# Altium schematic sheet MCU_Power.SchDoc
size A4
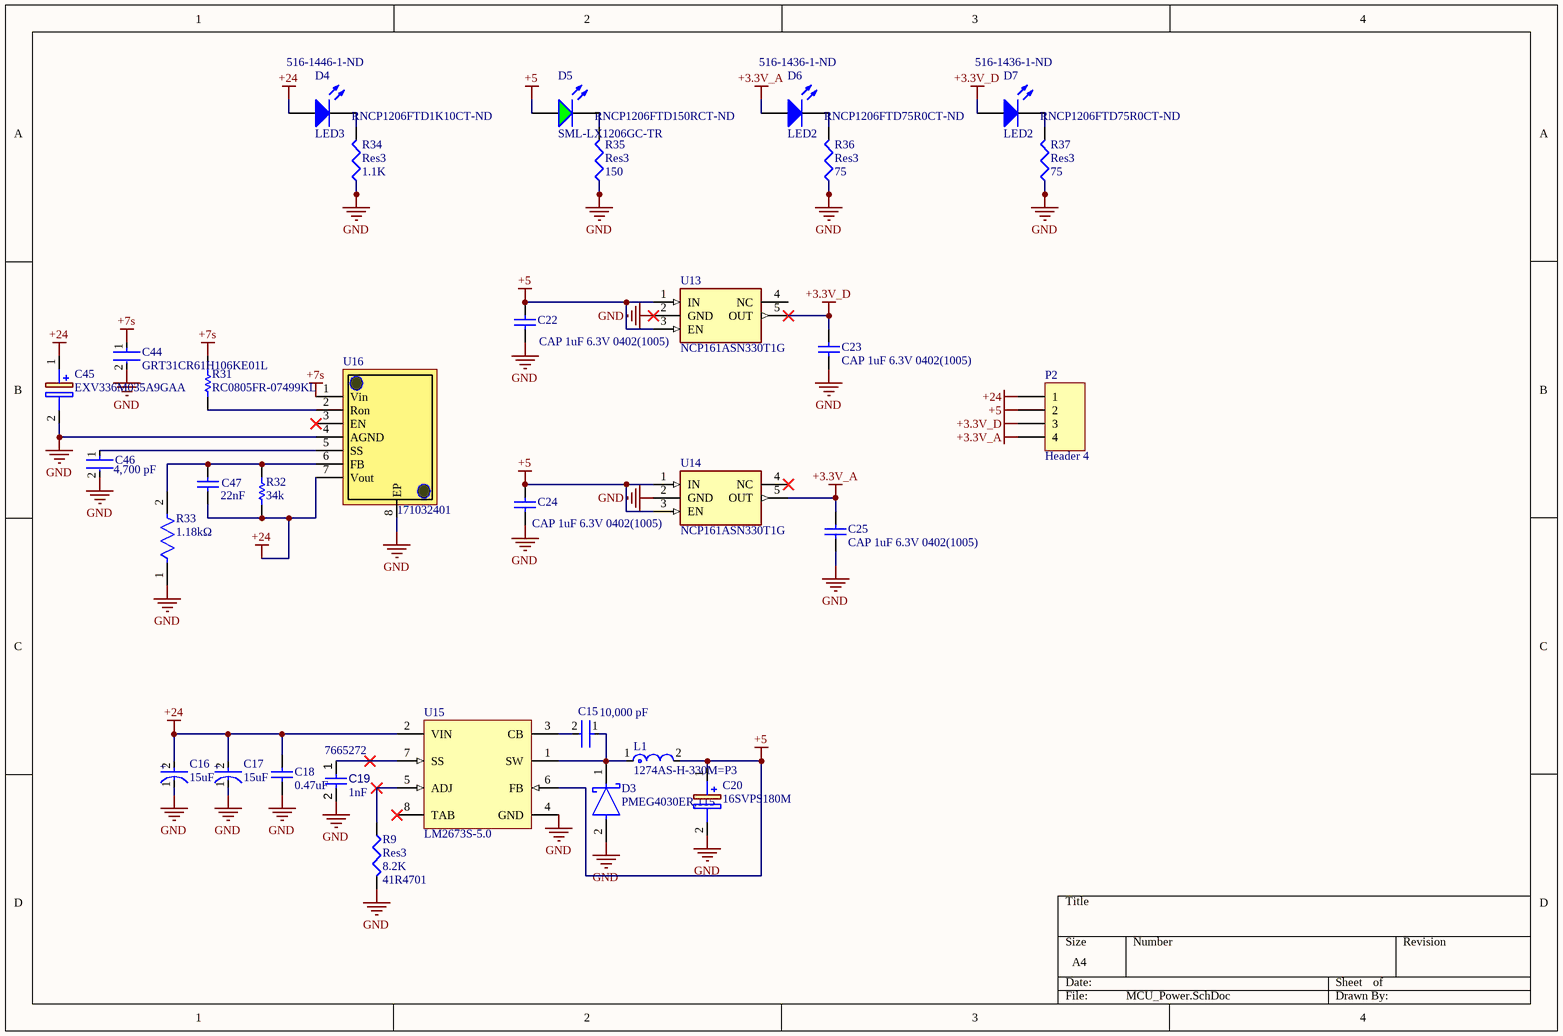
[diagram p0: MCU_Power.SchDoc]

## Parts
C15  value 10,000 pF  [FP-C0805C-DN-MFG]  (hidden comment: C0805C103J5RACTU)
C16  value 15uF  [FP-TPSE-MFG]  (hidden comment: TPSE156M050R0250)
C17  value 15uF  [FP-TPSE-MFG]  (hidden comment: TPSE156M050R0250)
C18  Parameter 1: 0.47uF  [CAPC2013X140X50ML20T25]  (hidden comment: C0805F474K3RACTU)
C19  value 1nF  Supplier Part Number 1: 7665272  [CAPC1608X90X40NL10T20]  (hidden comment: CAP CER 1000PF 50V X7R 0603)
C20  16SVPS180M  [10SVPS150M]
C22  CAP 1uF 6.3V 0402(1005)  [CAPC0402(1005)60_L]
C23  CAP 1uF 6.3V 0402(1005)  [CAPC0402(1005)60_L]
C24  CAP 1uF 6.3V 0402(1005)  [CAPC0402(1005)60_L]
C25  CAP 1uF 6.3V 0402(1005)  [CAPC0402(1005)60_L]
C44  GRT31CR61H106KE01L  [FP-GRT31C-0_2-IPC_A]
C45  EXV336M035A9GAA  [CAPAE660X565N]
C46  Capacitance: 4,700 pF  [FP-C0805C-DN-MFG]  (hidden comment: C0805C472K5RACTU)
C47  22nF  [CAPC2013X145X50NL20T25]
D3  PMEG4030ER,115  [FP-SOD123W-MFG]
D4  LED3  Supplier Part Number 1: 516-1446-1-ND  [C1206]
D5  SML-LX1206GC-TR  [LUMX-SML-LX1206GC-TR_V]
D6  LED2  Supplier Part Number 1: 516-1436-1-ND  [C1206]
D7  LED2  Supplier Part Number 1: 516-1436-1-ND  [C1206]
L1  1274AS-H-330M=P3  [FP-DEM10050C-MFG]
P2  Header 4  [HDR1X4]
R9  Res3  value 8.2K  Supplier Part Number 1: 41R4701  [J1-0603]
R31  RC0805FR-07499KL  [RESC2013X60X35LL10T20]
R32  value 34k  [RESC2013X60X40ML20T25]  (hidden comment: ERA6AEB3402V)
R33  value 1.18kΩ  [FP-RT0805-MFG]  (hidden comment: RT0805BRE071K18L)
R34  Res3  value 1.1K  Supplier Part Number 1: RNCP1206FTD1K10CT-ND  [C1206]
R35  Res3  value 150  Supplier Part Number 1: RNCP1206FTD150RCT-ND  [C1206]
R36  Res3  value 75  Supplier Part Number 1: RNCP1206FTD75R0CT-ND  [C1206]
R37  Res3  value 75  Supplier Part Number 1: RNCP1206FTD75R0CT-ND  [C1206]
U13  NCP161ASN330T1G  [SOT95P280X145-5N]
U14  NCP161ASN330T1G  [SOT95P280X145-5N]
U15  LM2673S-5.0  [KTW0007B_N]
U16  171032401  [7 PIN PFM]

## Nets
+3.3V_A: C25.2 D6.1(A) P2.4 U14.5(OUT)
+3.3V_D: C23.2 D7.1(A) P2.3 U13.5(OUT)
+5: C20.1(+) C22.2 C24.2 D5.1(A) L1.2 P2.2 U13.1(IN) U13.3(EN) U14.1(IN) U14.3(EN) U15.6(FB)
+7s: C44.1 R31.2 U16.1(Vin)
+24: C16.2(A) C17.2(A) C18.1 C45.1(+) C47.1 D4.1(A) P2.1 R32.1 U15.2(VIN) U16.7(Vout)
GND: C16.1(C) C17.1(C) C18.2 C19.2 C20.2(-) C22.1 C23.1 C24.1 C25.1 C44.2 C45.2(-) C46.2 D3.2(A) R9.2 R33.1 R34.1 R35.1 R36.1 R37.1 U13.2(GND) U14.2(GND) U15.4(GND) U16.4(AGND) U16.8(EP)
NetC15_1: C15.1 D3.1(C) L1.1 U15.1(SW)
NetC15_2: C15.2 U15.3(CB)
NetC19_1: C19.1 U15.7(SS)
NetC46_1: C46.1 U16.5(SS)
NetC47_2: C47.2 R32.2 R33.2 U16.6(FB)
NetD4_2: D4.2(K) R34.2
NetD5_2: D5.2(K) R35.2
NetD6_2: D6.2(K) R36.2
NetD7_2: D7.2(K) R37.2
NetR9_1: R9.1 U15.5(ADJ)
NetR31_1: R31.1 U16.2(Ron)

Not connected (* = marked no-connect by the designer): U13 4(NC); U14 4(NC)*; U15 8(TAB)*; U16 3(EN)*

## Notes on the sheet
- (in symbol CMP-04424-000028-1) +

## Library data of the parts
C15 = CMP-2007-00254-2: CAP CER 10000PF 50V X7R 0805; Manufacturer: KEMET; Material: Ceramic; Temperature Coefficient: 30ppm/°C; Tolerance: 0.05; Device Class L1: Passive Components; Temperature: -55°C to +125°C; Lead Free: Yes; ComponentLink2URL: https://content.kemet.com/datasheets/KEM_C1003_C0G_SMD.pdf; Device Class L3: Ceramic Capacitors; Temperature Characteristic: X7R; Temperature Range High: +125°C; Mouser Description: Capacitor; Ceramic; Cap 0.01uF; Tol 5%; Vol-Rtg 50 V; SMT; Case 0805; X7R; TR; ComponentLink2Description: Datasheet; Manufacturer Part Number: C0805C103J5RACTU; Height: 0.88mm; Digikey Description: CAP CER 10000PF 50V X7R 0805; Capacitance: 10,000 pF; Temperature Range Low: -55°C; Device Class L2: Capacitors; Octopart: https://octopart.com/c0805c103j5ractu-kemet-133473; Voltage Rating: 50 V; Category: Cap; RoHS: TRUE; Automotive: No; Package: C0805C-DN; Ipc Land Pattern Name: CAPC200125X78
C16 C17 = CMP-04424-000028-1: CAP TANT 15UF 20% 50V 2917; Manufacturer: AVX Corporation; Ripple Current: 0.812A; Esr: 250mΩ; Leakage Current: 7.5uA; Dissipation Factor: 6%; Material: Tantalum Mn02 solid electrolyte; Life: 1000Hours; Device Class L2: Capacitors; Lead Free: Yes; Temperature Range High: +125°C; ComponentLink2Description: Datasheet; Height: 4.3mm; Temperature: -55°C to +125°C; Octopart: https://octopart.com/tpse156m050r0250-avx-7476984; Mouser Description: Tantalum Capacitors - Solid SMD 15uF 20% 50Volts; Device Class L1: Passive Components; Category: Cap; Digikey Description: CAP TANT 15UF 20% 50V 2917; RoHS: TRUE; Temperature Range Low: -55°C; Voltage Rating: 50V; Capacitance: 15uF; Tolerance: 20%; Automotive: No; Package: TPSE; ComponentLink2URL: http://datasheets.avx.com/TPS.pdf; Device Class L3: Tantalum Capacitors; Manufacturer Part Number: TPSE156M050R0250; Footprint Url: https://www.avx.com/download/software/literature/AVX-Footprint-Library.pdf
C18 = CMP-2007-03309-1: Manufacturer: Kemet; Part Number: C0805F474K3RACTU
C19 = CMP-001-00017-6: 1000 pF ±10% 50V Ceramic Capacitor X7R 0603 (1608 Metric); Manufacturer: Samsung; Manufacturer Part Number: CL10B102KB8NNNC; Tolerance: 10%; Voltage Rating: 50V; Mounting Technology: SM; Max Operating Temperature: 125°C; RoHS Compliant: True; Pins: 2; Capacitor Type: Ceramic; Case/Package: 0603; Min Operating Temperature: -55°C; Supplier 1: RSComponents; RoHS: Yes; Category: Ceramic Capacitors; Stock 1: 164000; Pricing 1: 4000=0.00800, 12000=0.00800, 20000=0.00800, 40000=0.00700, 100000=0.00700 (USD); Mount: Surface Mount; Case Code (Metric): 1608; Case Code (Imperial): 0603; Material: Ceramic; Contact Plating: Tin; Capacitance: 1nF; Dielectric: X7R; Package Quantity: 1; Packaging: Tape and Reel; Voltage: 50V; Voltage Rating (DC): 50V; Series: CL; Construction: Flat; Length: 1.6mm; Width: 0.031inch; Height: 0.8mm; Thickness: 0.035inch; Depth: 0.8mm; Radiation Hardening: No; Lead Free: Lead Free; ComponentLink1URL: https://datasheet.ciiva.com/25805/cl10b102kb8nnnc-25805137.pdf?src-supplier=Digi-Key; ComponentLink1Description: https://datasheet.ciiva.com/25805/cl10b102kb8nnnc-25805137.pdf?src-supplier=Digi-Key; ComponentLink2URL: https://datasheet.ciiva.com/15216/getdatasheetpartid-359690-15216231.pdf?src-supplier=Verical; ComponentLink2Description: https://datasheet.ciiva.com/15216/getdatasheetpartid-359690-15216231.pdf?src-supplier=Verical; ComponentLink3URL: https://datasheet.ciiva.com/29198/458300-da-01-en-vs-kondensator-0603-29198498.pdf?src-supplier=Conrad; ComponentLink3Description: https://datasheet.ciiva.com/29198/458300-da-01-en-vs-kondensator-0603-29198498.pdf?src-supplier=Conrad; ComponentLink4URL: https://datasheet.ciiva.com/16199/cl05b104kq5nnnc-16199064.pdf?src-supplier=Future+Electronics; ComponentLink4Description: https://datasheet.ciiva.com/16199/cl05b104kq5nnnc-16199064.pdf?src-supplier=Future+Electronics; ComponentLink5URL: https://datasheet.ciiva.com/26310/mlcc-catalogdownload2013-eng-26310326.pdf?src-supplier=Distrelec; ComponentLink5Description: https://datasheet.ciiva.com/26310/mlcc-catalogdownload2013-eng-26310326.pdf?src-supplier=Distrelec
C20 = 16SVPS180M: Capacitor Polarised; Manufacturer_Name: Panasonic; Datasheet Link: http://industrial.panasonic.com/cdbs/www-data/pdf/AAB8000/AAB8000C232.pdf; Height: 8mm; Manufacturer_Part_Number: 16SVPS180M; Mouser Part Number: 667-16SVPS180M; Mouser Price/Stock: https://www.mouser.co.uk/ProductDetail/Panasonic/16SVPS180M?qs=r271rpOLewtQLZd4uWya%252Bg%3D%3D; Arrow Part Number: 16SVPS180M; Arrow Price/Stock: https://www.arrow.com/en/products/16svps180m/panasonic
C22-C25 = CMP-1034-02113-1: CAP 1uF 6.3V ±10% 0402 (1005 Metric) Thickness 0.6mm SMD; Case-Metric: 1005; Case-EIA: 0402; Tolerance: Â±10%; Value: 1uF; Technology: SMT; Rated Voltage: 6.3 V; Max Thickness: 0.6 mm
C44 = CMP-06035-000076-2: Multi-Layer Ceramic Capacitor 10uF 50V X5R ±10% 1206 Emboss T/R; Length: 0.126inch; Max Operating Temperature: 85°C; Width: 0.063inch; Ratings: AEC-Q200; Voltage Rating: 50V; Dielectric: X5R; Min Operating Temperature: -55°C; Case Code (Imperial): 1206; Capacitance: 10uF; Case Code (Metric): 3216; Thickness: 0.071inch; Tolerance: 10%; Mount: Surface Mount; Case/Package: 1206; Packaging: Cut Tape; Voltage Rating (DC): 50V
C45 = EXV336M035A9GAA: Capacitor Polarised; Manufacturer_Name: Kemet; Datasheet Link: https://www.kemet.com/specsheet/EXV336M035A9GAA; Height: 5.65mm; Manufacturer_Part_Number: EXV336M035A9GAA; Mouser Part Number: 80-EXV336M035A9GAA; Mouser Price/Stock: https://www.mouser.co.uk/ProductDetail/KEMET/EXV336M035A9GAA/?qs=E9QF1UCAUX6jRtOVEL%2FRng%3D%3D; Arrow Part Number: EXV336M035A9GAA; Arrow Price/Stock: https://www.arrow.com/en/products/exv336m035a9gaa/kemet-corporation
C46 = CMP-03020-025139-1: CAP CER 4700PF 50V X7R 0805; Manufacturer: KEMET; Value: 4,700 pF; Material: Ceramic; Tolerance: 0.1; Temperature Coefficient: 30ppm/°C; Temperature Characteristic: X7R; Manufacturer Part Number: C0805C472K5RACTU; Temperature Range Low: -55°C; Device Class L1: Passive Components; Lead Free: Yes; Category: Cap; ComponentLink2Description: Datasheet; ComponentLink2URL: https://content.kemet.com/datasheets/KEM_C1003_C0G_SMD.pdf; Device Class L3: Ceramic Capacitors; Digikey Description: CAP CER 4700PF 50V X7R 0805; RoHS: TRUE; Temperature Range High: +125°C; Voltage Rating: 50 V; Mouser Description: Cap Ceramic 0.0047uF 50V X7R 10% SMD 0805 125°C Paper T/R; Octopart: https://octopart.com/c0805c472k5ractu-kemet-86501; Automotive: No; Package: C0805C-DN; Height: 0.88mm; Device Class L2: Capacitors; Temperature: -55°C to +125°C; Ipc Land Pattern Name: CAPC200125X78
C47 = CMP-2007-01055-1: Part Number: C0805C223K1RACAUTO; Manufacturer: Kemet
D3 = CMP-14398-000026-1: DIODE SCHOTTKY 40V 3A SOD123W; RoHS Compliant: Yes
D4 = LED3: LED BLUE DIFFUSED CHIP SMD; Manufacturer: Broadcom Avago; Manufacturer Part Number: HSMN-C150; Lens Color: White; Viewing Angle: 170°; Luminous Intensity: 35mcd; Forward Voltage: 3.3V; Lens Style: Diffused,Colorless,Rectangular; Dominant Wavelength: 470nm; Test Current: 20mA; Wavelength: 468nm; Power Rating: 78mW; Number of Elements: 1; Reverse Voltage: 5V; Published: 8-Jun-2000; LatestRevisionDate: 17-Dec-2003; LatestRevisionNote: PCB Footprint replaced.; DatasheetVersion: 16-Apr-2002; PackageVersion: 16-Apr-2002; PackageReference: 3.5X2.8X1.9; Publisher: Altium Limited; PackageDescription: SM LED; 2 C-Bend Leads; Body 3.5 x 2.8 x 1.9 mm, inc leads (LxWxH typ); Supplier 1: Digi-Key; RoHS: Yes; Category: LEDs; Stock 1: 6063; Pricing 1: 1=1.00000, 10=0.77800, 100=0.50000, 500=0.42218, 1000=0.33330 (USD); Mount: Surface Mount; Case/Package: 1206; Number of Pins: 2; Color: Blue; Case Code (Metric): 3216; Case Code (Imperial): 1206; Min Operating Temperature: -40°C; Max Operating Temperature: 85°C; Packaging: Tape and Reel; Lens Transparency: Diffused; Forward Current: 20mA; Package Quantity: 1; Illumination Color: Blue; Power Dissipation: 78mW; Number of LEDs: 1; Length: 3.2mm; Height: 1.1mm; Width: 1.6mm; Depth: 1.6mm; Radiation Hardening: No; Lead Free: Lead Free; ComponentLink1URL: https://datasheet.ciiva.com/11773/0900766b804a6539-11773988.pdf?src-supplier=RSComponents; ComponentLink1Description: https://datasheet.ciiva.com/11773/0900766b804a6539-11773988.pdf?src-supplier=RSComponents; ComponentLink2URL: https://datasheet.ciiva.com/15117/getdatasheetpartid-128275-15117643.pdf?src-supplier=Verical; ComponentLink2Description: https://datasheet.ciiva.com/15117/getdatasheetpartid-128275-15117643.pdf?src-supplier=Verical; ComponentLink3URL: https://datasheet.ciiva.com/4688/v02-0592en-13727-4688526.pdf?src-supplier=Mouser; ComponentLink3Description: https://datasheet.ciiva.com/4688/v02-0592en-13727-4688526.pdf?src-supplier=Mouser
D5 = CMP-2000-07122-1: Green Led, Water Clear Lens, 10 mcd, 565 nm, 2.2 V, -40 to 85 degC, 2-Pin SMD, RoHS, Tape and Reel; Manufacturer: Lumex; Number of LEDs: 1; Type: Uni-Color; Viewing Angle: 160; Pin_Count: 2; Intensity: 10mcd; Reverse Voltage: 5(Min)V; COO: CN; LED Material: GaP; Peak Wavelength: 565nm; Lens Appearance: ColorlessNonDiffused; Datasheet Version: Rev. J, 04/2011; Package Description: 2-Pin Surface Mount Device, Body 3.2 x 1.6 mm; Part No: SML-LX1206GC-TR; Lens Dimensions: 2x1.6x0.5mm; Dimension: 3.2x1.6x1.1mm; Color: Green; Supplier: Lumex; Supplier Standard Pack: 3,000; Manufacturer URL: http://www.lumexinstruments.com/; Dominant Wavelength: N/A; ECCN: EAR99; Datasheet URL: http://www.mouser.com/ds/2/244/SML-LX1206GC-TR-112732.pdf; HTS: 8541402000; Mounting: SurfaceMount; Package Reference: SML-LX1206GC-TR; Family: SML-LX1206GC; Packaging: TapeandReel; RoHS: Yes; Operating Temperature: -40to85C; Supplier_Package: SMD; Mounting Technology: SurfaceMount
D6 D7 = LED2: LED, BLUE, 55MCD, 473NM; LED Colour:Blue; Bulb Size:-; Wavelength Typ:473nm; Forward Voltage:3.4V; Forward Current If:20mA; Luminous Intensity:55mcd; LED Mounting:SMD; Lens Shape:Rectangular; Viewing Angle:140 ; Packaging:Cut Tape; ;RoHS Compliant: Yes; Manufacturer: Broadcom Avago; Manufacturer Part Number: HSMR-C150; Lens Color: White; Lens Style: Rectangular,Diffused,Colorless; Viewing Angle: 140°; Forward Voltage: 3.4V; Forward Current: 20mA; Lens Transparency: Diffused; Power Dissipation: 78mW; Voltage Rating (DC): 3.9V; Number of Elements: 1; Reverse Voltage: 5V; Published: 8-Jun-2000; LatestRevisionDate: 17-Jul-2002; LatestRevisionNote: Re-released for DXP Platform.; PackageVersion: Feb-2002; PackageReference: 3.2X1.6X1.1; Publisher: Altium Limited; PackageDescription: SM LED; 2 Flat Leads; Supplier 1: Digi-Key; RoHS: Yes; Category: LEDs; Stock 1: 16212; Pricing 1: 1=0.82000, 10=0.63600, 100=0.40910, 500=0.34542, 1000=0.27270 (USD); Mount: Surface Mount; Case/Package: 1206; Number of Pins: 2; Color: Blue; Case Code (Metric): 3216; Case Code (Imperial): 1206; Min Operating Temperature: -40°C; Max Operating Temperature: 85°C; Luminous Intensity: 55mcd; Packaging: Tape and Reel; Wavelength: 473nm; Dominant Wavelength: 473nm; Test Current: 20mA; Package Quantity: 1; Illumination Color: Blue; Power Rating: 78mW; Number of LEDs: 1; Max Power Dissipation: 78mW; Length: 3.2mm; Height: 1.1mm; Width: 1.6mm; Depth: 1.6mm; Radiation Hardening: No; REACH SVHC: No SVHC; Lead Free: Lead Free
L1 = CMP-06042-015462-1: Shielded Wirewound Inductor 33uH 20% 2500mA 0.0936Ω SMD; Saturation Current: 3.5A; Core Material: Ferrite; Current Rating: 2.5A; Test Frequency: 100kHz; DC Resistance (DCR): 93.6mR; Inductance: 33uH; Mount: Surface Mount; Height - Seated (Max): 0.197inch; Length: 0.394inch; Shielding: Shielded; Resistor Type: Wirewound; Case/Package: SMD/SMT; Max DC Current: 2.5A; Width: 0.394inch; Number of Pins: 2; Tolerance: 20%; Packaging: Tape and Reel
P2 = Header 4: Header, 4-Pin; LatestRevisionDate: 17-Jul-2002; LatestRevisionNote: Re-released for DXP Platform.; Publisher: Altium Limited
R9 = Res3: Res Thick Film 0603 8.2K Ohm 1% 0.33W(1/3W) ±100ppm/°C Pad SMD Automotive T/R; Manufacturer: Vishay; Manufacturer Part Number: CRCW06038K20FKEAHP; Resistance: 8.2kR; Power Rating: 250mW; Voltage Rating: 75V; Published: 8-Jun-2000; LatestRevisionDate: 29-May-2009; LatestRevisionNote: IPC-7351 Footprint Added.; PackageReference: J1-0603; Publisher: Altium Limited; PackageDescription: Chip Resistor; Supplier 1: Newark; RoHS: Yes; Category: Chip SMD Resistors; Stock 1: 1560; Pricing 1: 1=0.15000, 10=0.13000, 25=0.10600, 50=0.08200, 100=0.05800, 250=0.05300 (USD); Mount: Surface Mount; Case/Package: 0603; Contact Plating: Tin; Case Code (Metric): 1608; Case Code (Imperial): 0603; Min Operating Temperature: -55°C; Max Operating Temperature: 155°C; Tolerance: 1%; Resistor Type: Thick Film; Temperature Coefficient: 100ppm/°C; Package Quantity: 5000; Packaging: Tape and Reel; Number of Terminations: 2; Termination: SMD/SMT; Max Power Dissipation: 250mW; Voltage Rating (DC): 75V; Features: Automotive AEC-Q200; Series: CRCW-HP; Resistance Tolerance: 1%; Construction: Rectangular; Technology: THICK FILM; Length: 1.6mm; Width: 0.033inch; Height: 0.022inch; Depth: 0.85mm; Radiation Hardening: No; REACH SVHC: Unknown; Military Standard: Not; Lead Free: Lead Free; RoHS Compliant: Yes; ComponentLink1URL: https://datasheet.ciiva.com/2527/crcwhpe3-2527252.pdf?src-supplier=Digi-Key; ComponentLink1Description: https://datasheet.ciiva.com/2527/crcwhpe3-2527252.pdf?src-supplier=Digi-Key; ComponentLink2URL: https://datasheet.ciiva.com/2527/crcwhpe3-2527253.pdf?src-supplier=Digi-Key; ComponentLink2Description: https://datasheet.ciiva.com/2527/crcwhpe3-2527253.pdf?src-supplier=Digi-Key; ComponentLink3URL: https://datasheet.ciiva.com/2527/crcwhpe3-2527254.pdf?src-supplier=Digi-Key; ComponentLink3Description: https://datasheet.ciiva.com/2527/crcwhpe3-2527254.pdf?src-supplier=Digi-Key; ComponentLink4URL: https://datasheet.ciiva.com/7841/424479-7841625.pdf?src-supplier=Element14; ComponentLink4Description: https://datasheet.ciiva.com/7841/424479-7841625.pdf?src-supplier=Element14; ComponentLink5URL: https://datasheet.ciiva.com/7841/424479-7841626.pdf?src-supplier=Element14; ComponentLink5Description: https://datasheet.ciiva.com/7841/424479-7841626.pdf?src-supplier=Element14; ComponentLink6URL: https://datasheet.ciiva.com/16883/crcwhpe3-16883528.pdf?src-supplier=Avnet+Europe; ComponentLink6Description: https://datasheet.ciiva.com/16883/crcwhpe3-16883528.pdf?src-supplier=Avnet+Europe
R31 = CMP-2001-01165-1: Manufacturer: Yageo; Part Number: RC0805FR-07499KL
R32 = CMP-2001-00803-1: Manufacturer: Panasonic; Part Number: ERA6AEB3402V
R33 = CMP-03412-010286-1: RES SMD 1.18K OHM 0.1% 1/8W 0805; Manufacturer: Yageo; Temperature Coefficient: 50 ppm/°C; Voltage Rating: 150V; Power Rating: 0.125W; Tolerance: 0.0025; Lead Free: Yes; Manufacturer Part Number: RT0805BRE071K18L; Temperature Range Low: -55°C; Device Class L3: Chip SMD Resistors; RoHS: TRUE; Temperature: -55°C to +155°C; Ipc Land Pattern Name: RESC200125X50; Device Class L2: Resistors; ComponentLink2Description: Datasheet; Automotive: No; Digikey Description: RES SMD 1.18K OHM 0.1% 1/8W 0805; Category: Res; ComponentLink2URL: http://www.yageo.com/documents/recent/PYu-RT_1-to-0.01_RoHS_L_9.pdf; Series: RT; Package: RT0805; Device Class L1: Passive Components; Octopart: https://octopart.com/rt0805bre071k18l-yageo-1175281; Footprint Url: http://www.yageo.com/exep/pages/download/literatures/PYu-R_Mount_10.pdf; Composition: Thin Film; Height: 0.6mm; Resistance: 1.18KΩ; Temperature Range High: +155°C
R34 = Res3: RES SMD 1.1K OHM 1% 1/2W 1206; Manufacturer: Stackpole Electronics; Manufacturer Part Number: RNCP1206FTD1K10; Resistance: 1.1kR; Max Power Dissipation: 500mW; Temperature Coefficient: 100ppm/°C; Published: 8-Jun-2000; LatestRevisionDate: 29-May-2009; LatestRevisionNote: IPC-7351 Footprint Added.; PackageReference: J1-0603; Publisher: Altium Limited; PackageDescription: Chip Resistor; Supplier 1: Digi-Key; RoHS: Yes; Category: Chip SMD Resistors; Stock 1: 17664; Pricing 1: 1=0.10000, 10=0.08100, 100=0.03100, 1000=0.01364, 2500=0.01178 (USD); Mount: Surface Mount; Case/Package: 1206; Case Code (Metric): 3216; Case Code (Imperial): 1206; Contact Plating: Tin; Min Operating Temperature: -55°C; Max Operating Temperature: 155°C; Resistor Type: Thin Film; Number of Terminations: 2; Features: Moisture Resistant,Anti-Sulfur; Tolerance: 1%; Packaging: Tape and Reel; Length: 0.122inch; Height: 0.024inch; Width: 0.059inch; Radiation Hardening: No; ComponentLink1URL: https://www.seielect.com/catalog/SEI-Packaging.pdf?src-supplier=Digi-Key; ComponentLink1Description: https://www.seielect.com/catalog/SEI-Packaging.pdf?src-supplier=Digi-Key; ComponentLink2URL: http://www.seielect.com/Catalog/SEI-rncp.pdf?src-supplier=Digi-Key; ComponentLink2Description: http://www.seielect.com/Catalog/SEI-rncp.pdf?src-supplier=Digi-Key; ComponentLink3URL: http://www.seielect.com/Catalog/SEI-RNCP.pdf?src-supplier=Avnet; ComponentLink3Description: http://www.seielect.com/Catalog/SEI-RNCP.pdf?src-supplier=Avnet
R35 = Res3: RES SMD 150 OHM 1% 1/2W 1206; Manufacturer: Stackpole Electronics; Manufacturer Part Number: RNCP1206FTD150R; Resistance: 150R; Max Power Dissipation: 500mW; Temperature Coefficient: 100ppm/°C; Published: 8-Jun-2000; LatestRevisionDate: 29-May-2009; LatestRevisionNote: IPC-7351 Footprint Added.; PackageReference: J1-0603; Publisher: Altium Limited; PackageDescription: Chip Resistor; Supplier 1: Digi-Key; RoHS: Yes; Category: Chip SMD Resistors; Stock 1: 93897; Pricing 1: 1=0.10000, 10=0.08100, 100=0.03100, 1000=0.01364, 2500=0.01178 (USD); Mount: Surface Mount; Case/Package: 1206; Case Code (Metric): 3216; Case Code (Imperial): 1206; Min Operating Temperature: -55°C; Max Operating Temperature: 155°C; Resistor Type: Thin Film; Number of Terminations: 2; Features: Moisture Resistant,Anti-Sulfur; Tolerance: 1%; Packaging: Tape and Reel; Length: 0.122inch; Height: 0.024inch; Width: 0.059inch; Lead Free: Lead Free; ComponentLink1URL: https://www.seielect.com/Catalog/SEI-rncp.pdf?src-supplier=Avnet; ComponentLink1Description: https://www.seielect.com/Catalog/SEI-rncp.pdf?src-supplier=Avnet; ComponentLink2URL: http://www.seielect.com/Catalog/SEI-rncp.pdf?src-supplier=Digi-Key; ComponentLink2Description: http://www.seielect.com/Catalog/SEI-rncp.pdf?src-supplier=Digi-Key; ComponentLink3URL: https://www.seielect.com/catalog/SEI-Packaging.pdf?src-supplier=Digi-Key; ComponentLink3Description: https://www.seielect.com/catalog/SEI-Packaging.pdf?src-supplier=Digi-Key
R36 R37 = Res3: RES 75 OHM 1% 1/2W 1206; Manufacturer: Stackpole Electronics; Manufacturer Part Number: RNCP1206FTD75R0; Resistance: 75R; Max Power Dissipation: 500mW; Temperature Coefficient: 100ppm/°C; Published: 8-Jun-2000; LatestRevisionDate: 29-May-2009; LatestRevisionNote: IPC-7351 Footprint Added.; PackageReference: J1-0603; Publisher: Altium Limited; PackageDescription: Chip Resistor; Supplier 1: Digi-Key; RoHS: Yes; Category: Chip SMD Resistors; Stock 1: 43503; Pricing 1: 1=0.10000, 10=0.08100, 100=0.03100, 1000=0.01364, 2500=0.01178 (USD); Mount: Surface Mount; Case/Package: 1206; Case Code (Metric): 3216; Case Code (Imperial): 1206; Min Operating Temperature: -55°C; Max Operating Temperature: 155°C; Packaging: Tape and Reel; Resistor Type: Thin Film; Number of Terminations: 2; Tolerance: 1%; Features: Moisture Resistant,Anti-Sulfur; Length: 0.122inch; Height: 0.024inch; Width: 0.059inch; ComponentLink1URL: https://www.seielect.com/catalog/SEI-Packaging.pdf?src-supplier=Digi-Key; ComponentLink1Description: https://www.seielect.com/catalog/SEI-Packaging.pdf?src-supplier=Digi-Key; ComponentLink2URL: https://www.seielect.com/Catalog/SEI-rncp.pdf?src-supplier=Digi-Key; ComponentLink2Description: https://www.seielect.com/Catalog/SEI-rncp.pdf?src-supplier=Digi-Key; ComponentLink3URL: http://www.seielect.com/Catalog/SEI-rncp.pdf?src-supplier=Digi-Key; ComponentLink3Description: http://www.seielect.com/Catalog/SEI-rncp.pdf?src-supplier=Digi-Key
U13 U14 = NCP161ASN330T1G: Power Supply; Manufacturer_Name: ON Semiconductor; Datasheet Link: https://componentsearchengine.com/Datasheets/2/NCP161ASN330T1G.pdf; Height: 1.45mm; Manufacturer_Part_Number: NCP161ASN330T1G; Mouser Part Number: 863-NCP161ASN330T1G; Mouser Price/Stock: https://www.mouser.co.uk/ProductDetail/onsemi/NCP161ASN330T1G?qs=vLWxofP3U2ze5zA%252BHmAd3w%3D%3D; Arrow Part Number: NCP161ASN330T1G; Arrow Price/Stock: https://www.arrow.com/en/products/ncp161asn330t1g/on-semiconductor
U15 = CMP-0069-00173-3: 3A Step-Down Voltage Regulator with Adjustable Current Limit, 7-pin TO-263; Manufacturer: Texas Instruments; PackageTopMarking: NSUZXYTTE#*LM2673*S-5.0; PowerWise: N; CompType: Switcher; PackageDescription: TO-263, Molded, .400 x .390 x .180in Body, 7 Lead, .050in Pitch, Surface Mount; ComponentLink1Description: Datasheet URL; RoHS: N; Code_JEDEC: MO-169-AC; PackageReference: KTW0007B; ComponentLink1URL: http://www.ti.com/general/docs/lit/getliterature.tsp?genericPartNumber=LM2673&fileType=pdf; PinCount: 7
U16 = CMP-1496-00005-1: MagI³C-VDRM Variable Step Down Regulator Module WE-VDRM , Ui=6-42V; Manufacturer: Wuerth Elektronik; Ui: 6-42 V; ComponentLink1Description: Manufacturer URL; ComponentLink2Description: Datasheet; ComponentLink1URL: http://www.we-online.com; ComponentLink2URL: http://katalog-live.we-online.de/pm/datasheet/171032401.pdf; PartNumber: 171032401; PackageReference: 7 PIN PFM